# Altium schematic sheet Sheet6.SchDoc
size A3; Organization: Altium Limited; Address1: L3, 12a Rodborough Rd; Address2: Frenchs Forest; Address3: NSW; Address4: Australia 2086; SheetNumber: 6; SheetTotal: 6
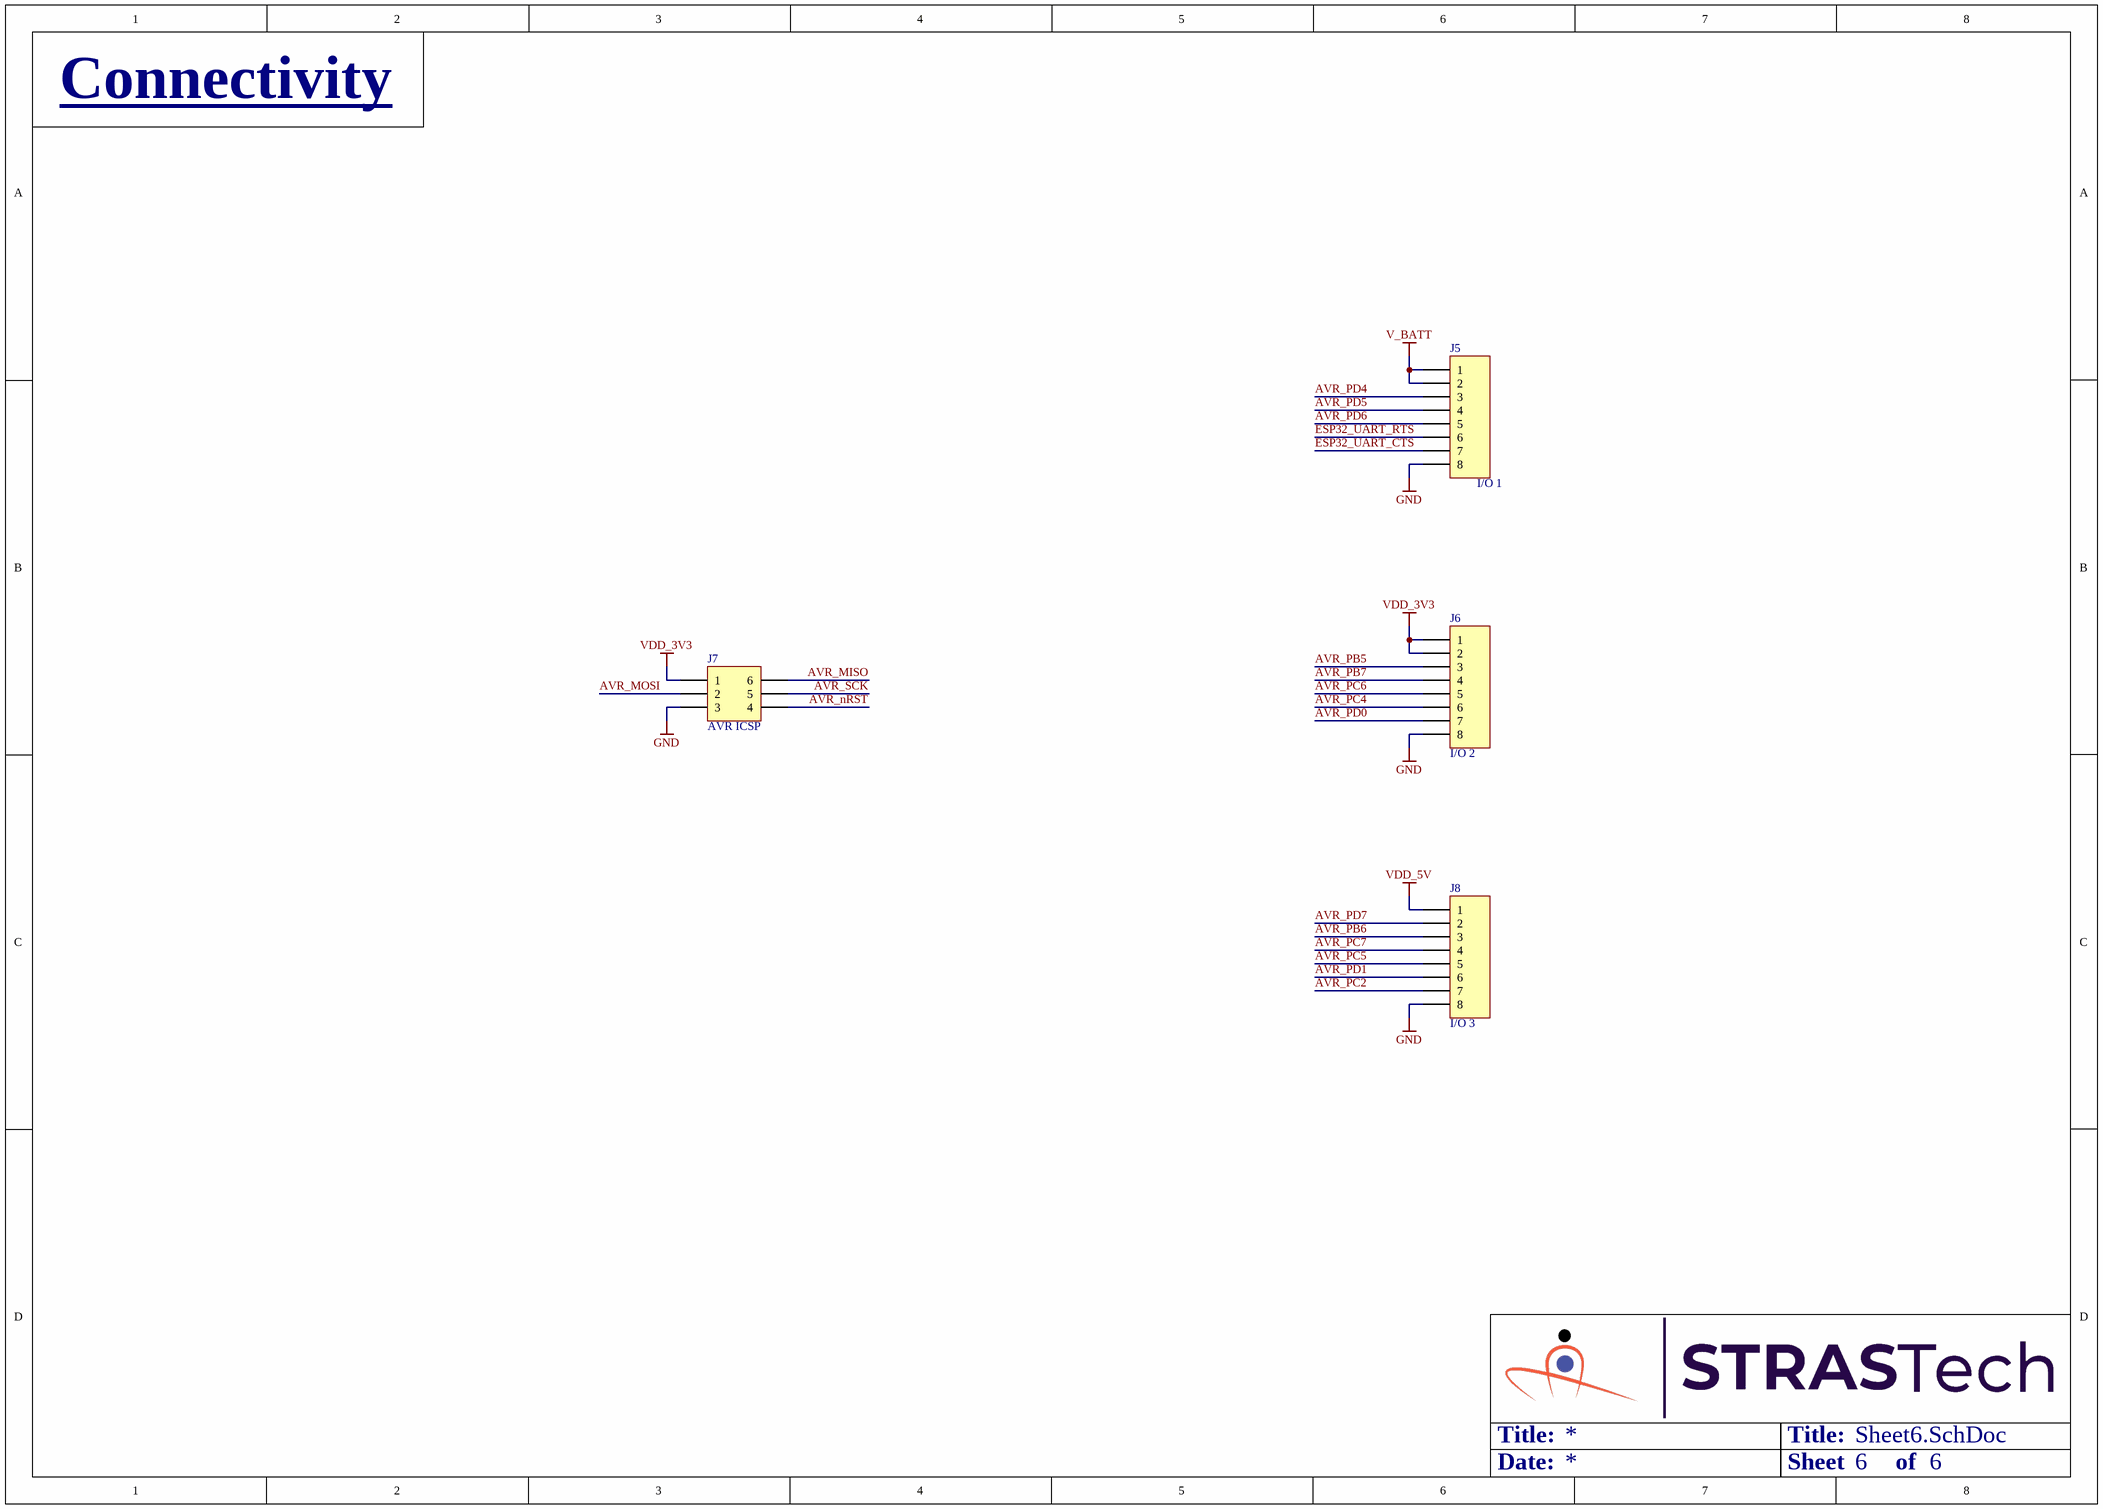
[diagram p0: Sheet6.SchDoc]

## Parts
J5  Term,Header,8 Pin,Top,2.54mm  [Term,Header,8Pin,2.54mm]  (value not drawn)
J6  Term,Header,8 Pin,Top,2.54mm  [Term,Header,8Pin,2.54mm]  (value not drawn)
J7  Term,Header,3x2 Pin,2.54mm,SMD  [TERM,HEADER,3X2PIN,P2.54,SMD]  (value not drawn)
J8  Term,Header,8 Pin,Top,2.54mm  [Term,Header,8Pin,2.54mm]  (value not drawn)

## Nets
GND: J5.8 J6.8 J7.3 J8.8
V_BATT: J5.1 J5.2
VDD_3V3: J6.1 J6.2 J7.1
VDD_5V: J8.1
AVR_MISO: J7.6
AVR_MOSI: J7.2
AVR_nRST: J7.4
AVR_PB5: J6.3
AVR_PB6: J8.3
AVR_PB7: J6.4
AVR_PC2: J8.7
AVR_PC4: J6.6
AVR_PC5: J8.5
AVR_PC6: J6.5
AVR_PC7: J8.4
AVR_PD0: J6.7
AVR_PD1: J8.6
AVR_PD4: J5.3
AVR_PD5: J5.4
AVR_PD6: J5.5
AVR_PD7: J8.2
AVR_SCK: J7.5
ESP32_UART_CTS: J5.7
ESP32_UART_RTS: J5.6

## Notes on the sheet
- Connectivity
- (near J5) I/O 1
- (near J7) AVR ICSP
- (near J6) I/O 2
- (near J8) I/O 3
- Title:
- Date:
- Sheet
- of
- Title
- Size:
- A3
- Revision:
- Design By:

## Library data of the parts
J5 J6 J8 = Term,Header,8 Pin,Top,2.54mm: CONN HEADER VERT 8POS 2.54MM; Vendor Part Number: 732-5321-ND; Manufacturer: Würth Elektronik; Manufacturer Part Number: 61300811121; Vendor: Digikey; HelpURL: https://katalog.we-online.de/em/datasheet/6130xx11121.pdf; Created By: Judd Foster
J7 = Term,Header,3x2 Pin,2.54mm,SMD: Connector Header Surface Mount 6 position 0.100" (2.54mm); Vendor Part Number: 609-10129383-906002ALFCT-ND; Manufacturer: Amphenol ICC (FCI); Manufacturer Part Number: 10129383-906002ALF; Vendor: Digikey; HelpURL: https://cdn.amphenol-icc.com/media/wysiwyg/files/drawing/10129383.pdf; CreatedBy: Judd Foster